# Altium schematic sheet cover_page.SchDoc
size A4; Email: eliofagundez07@gmail.com; DrawnBy: Elio F.; Engineer: Elio F.; Revision: A; SheetNumber: 1; SheetTotal: 15; Sheet Title: Cover Page
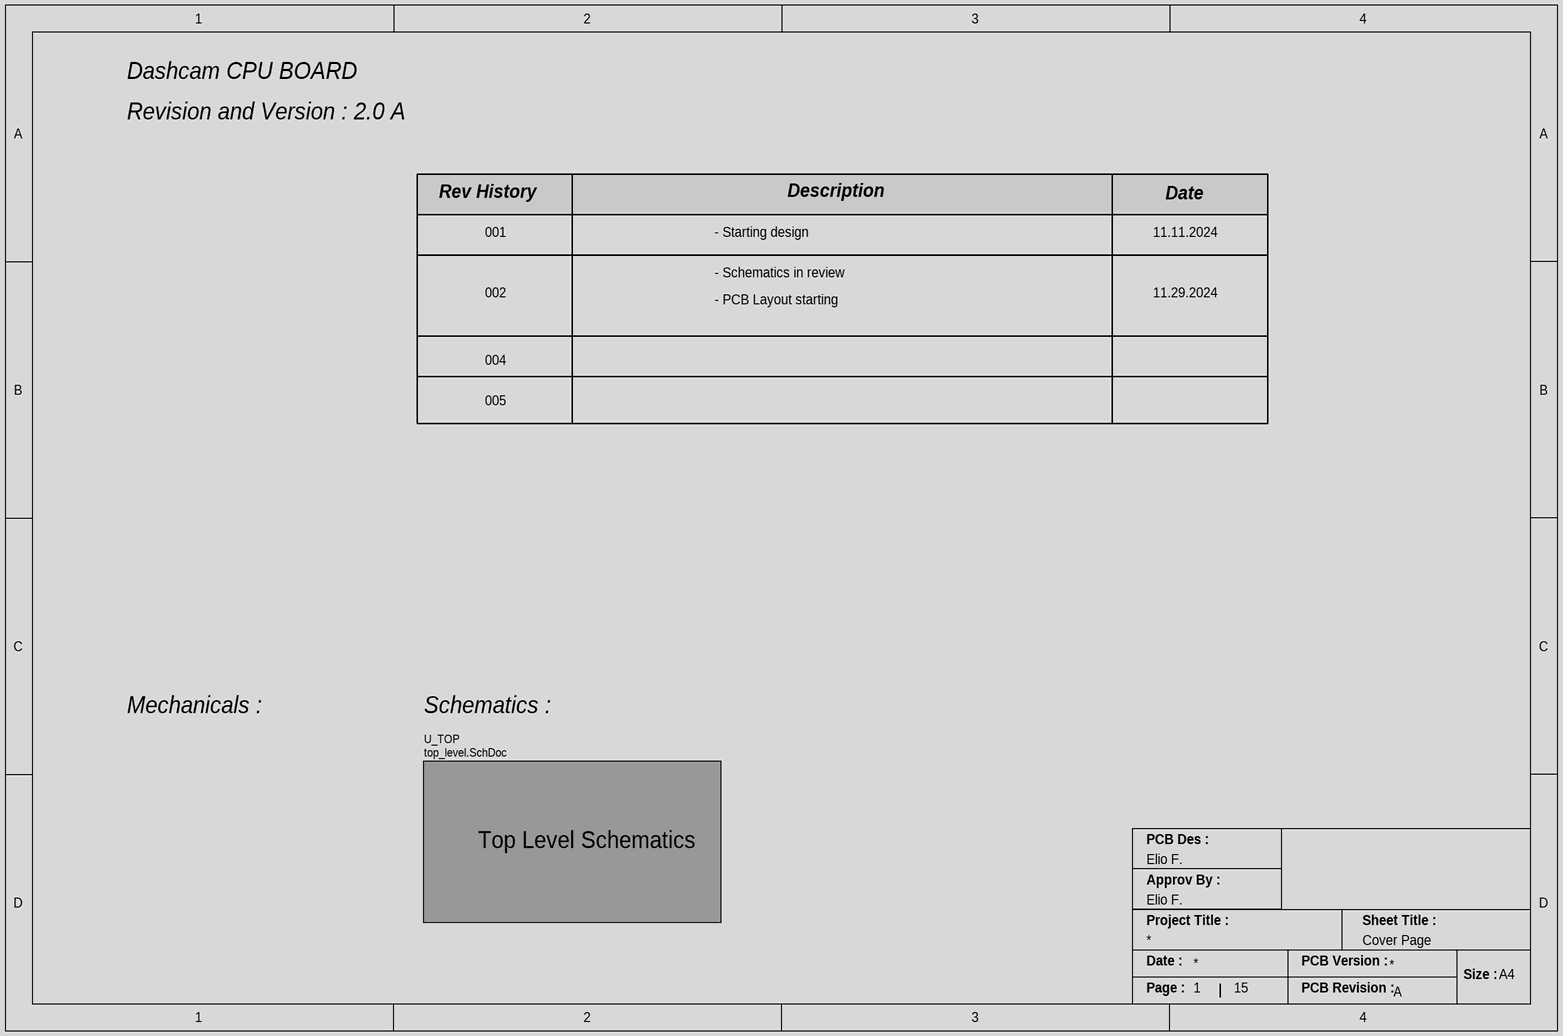
[diagram p0: cover_page.SchDoc]

## Sub-sheets
U_TOP = top_level.SchDoc: no entries

## Notes on the sheet
- Dashcam CPU BOARD
- Revision and Version : 2.0 A
- Rev History
- 001
- - Starting design
- Description
- 11.11.2024
- Date
- 002
- - Schematics in review
- - PCB Layout starting
- 11.29.2024
- 004
- 005
- Mechanicals :
- Schematics :
- Top Level Schematics
- PCB Des :
- Approv By :
- Project Title :
- Sheet Title :
- Date :
- PCB Version :
- Size :
- A4
- Page :
- PCB Revision :